# Altium schematic sheet ORD_BYPASS.SchDoc
size 420 x 297 mm; Address1: Address1; Address2: Address2; Address3: Address3; Address4: Address4; DocumentNumber: АБВГ.123456.001 Э3; SheetNumber: 1; Scale: 1:1; DocumentType: Схема электрическая принципиальная; FirstReferrence: АБВГ.123456.001
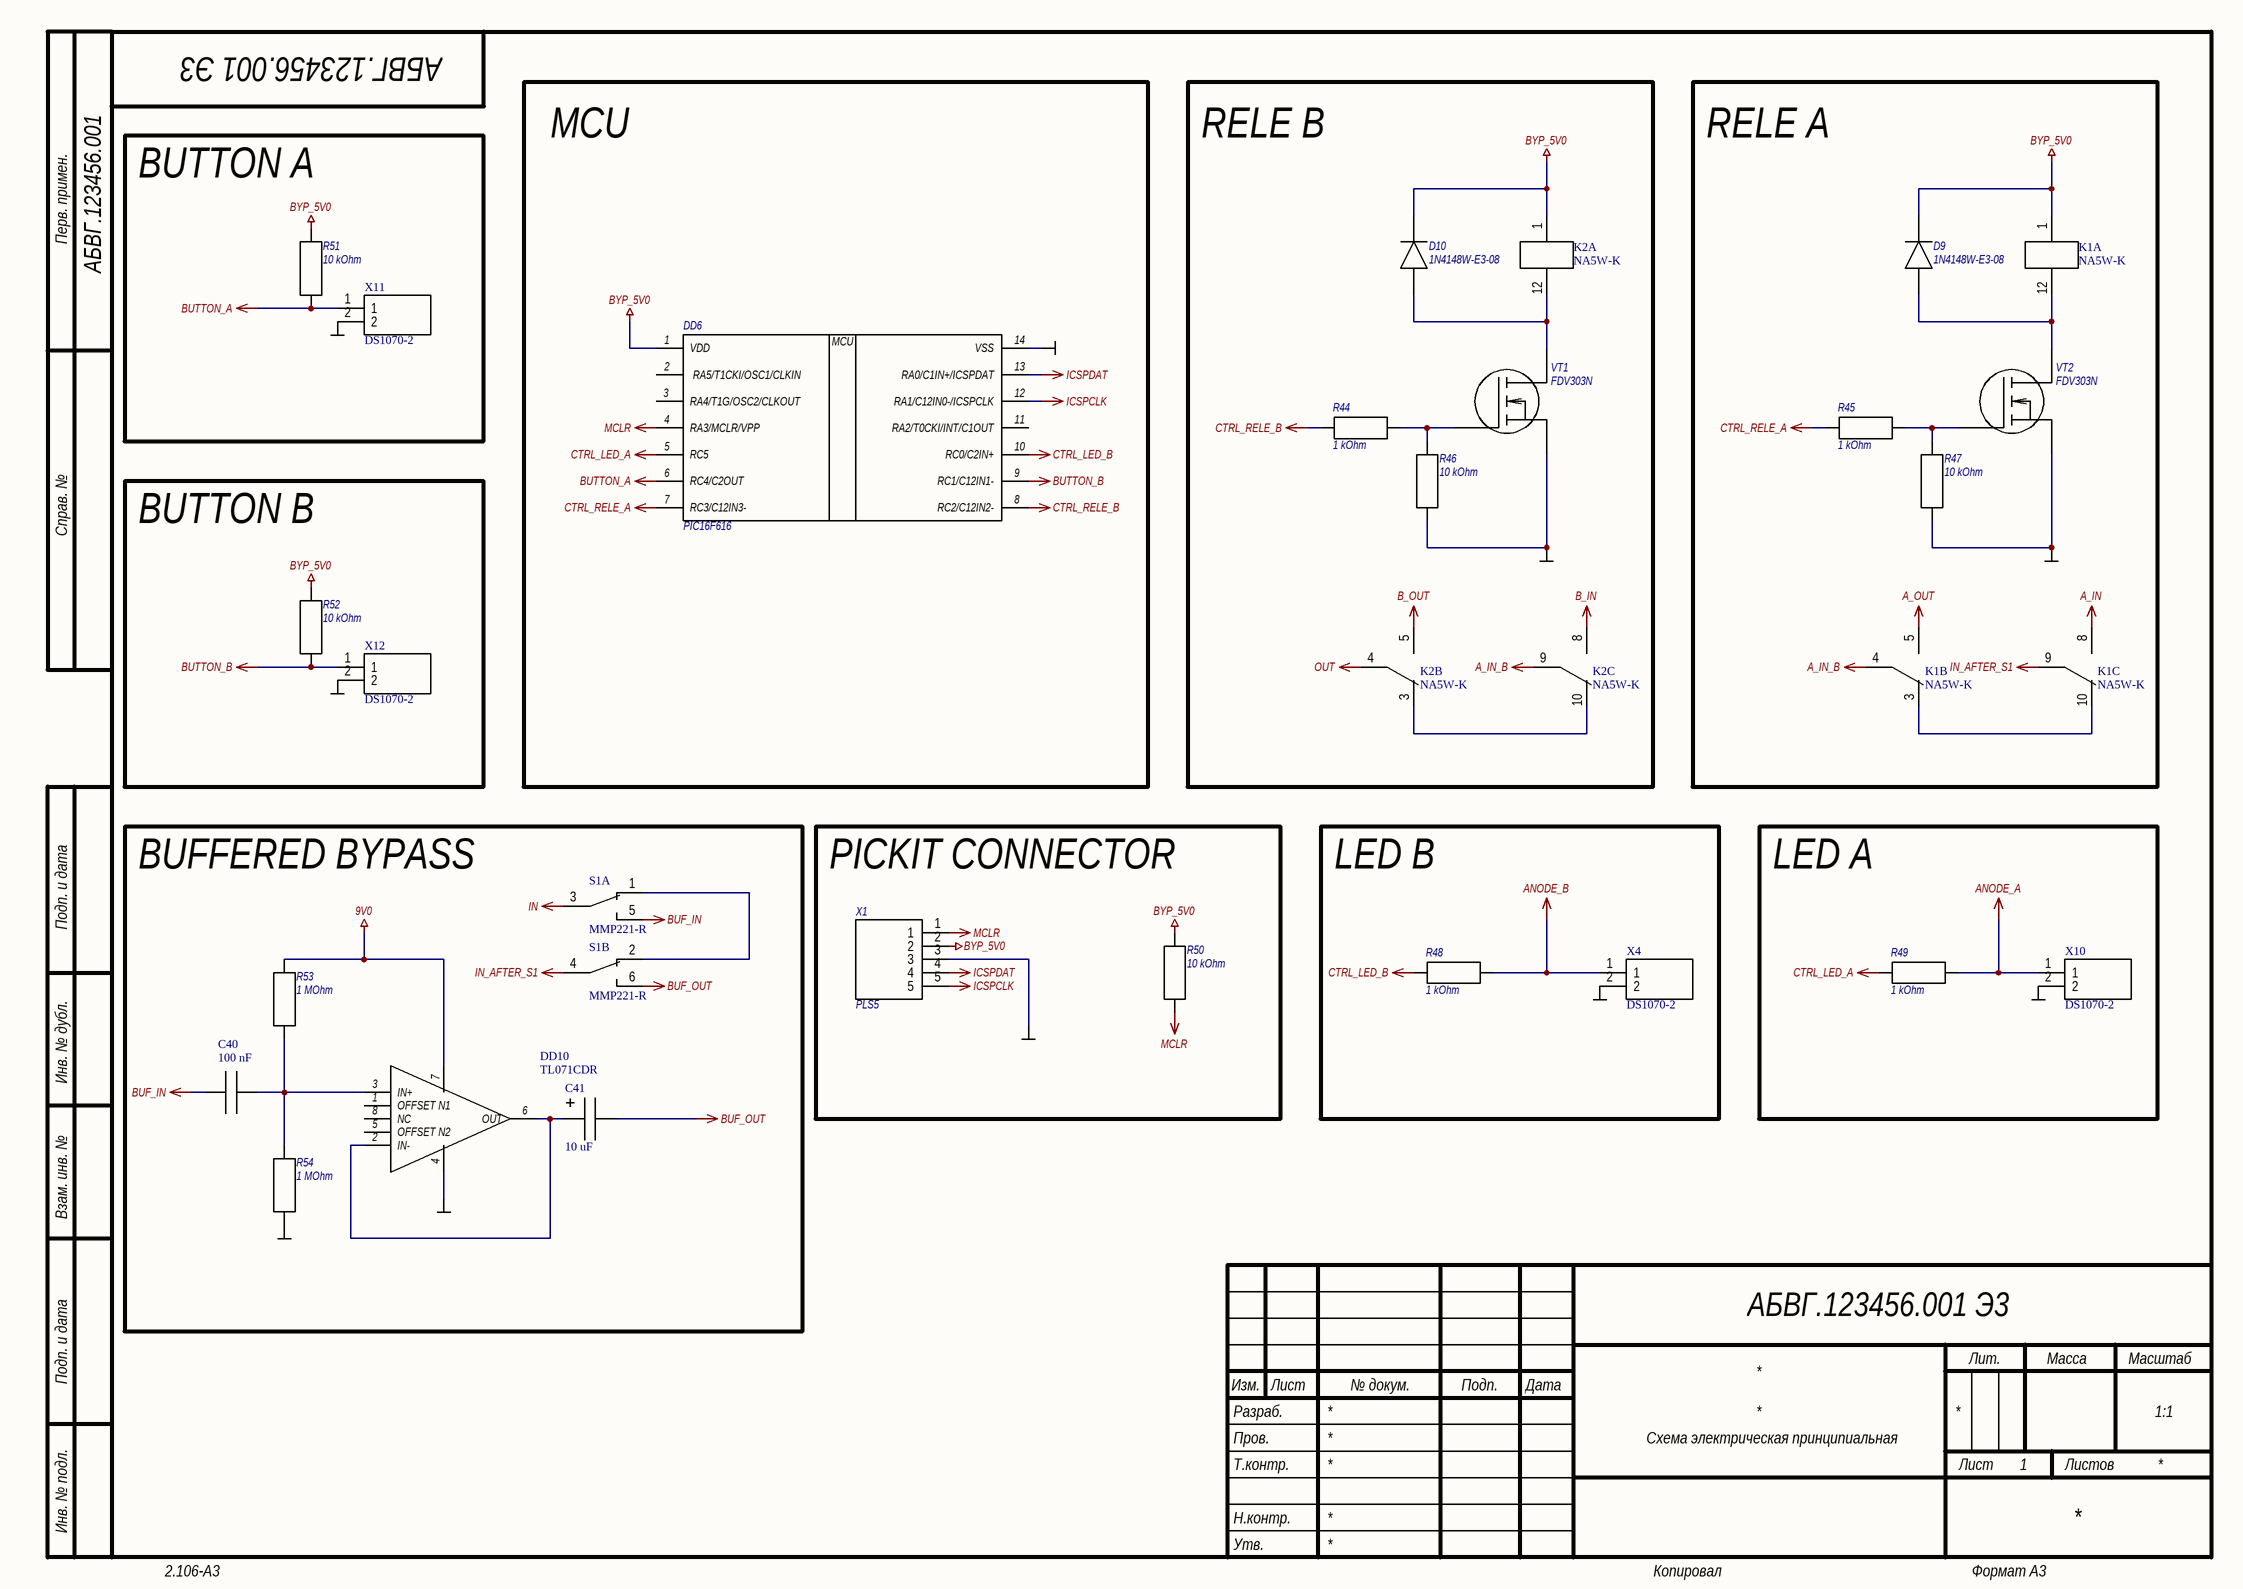
[diagram p0: ORD_BYPASS.SchDoc]

## Parts
C40  100 nF  [C0805[2012]]
C41  10 uF  [C3216_CASE-A]
D9  1N4148W-E3-08  [SOD123]
D10  1N4148W-E3-08  [SOD123]
DD6  PIC16F616  [SO14]
DD10  TL071CDR  [SO8]
K1  NA5W-K  [NA5W-K]  (parts A,B,C of 3)
K2  NA5W-K  [NA5W-K]  (parts A,B,C of 3)
R44  1 kOhm  [R0805[2012]]
R45  1 kOhm  [R0805[2012]]
R46  10 kOhm  [R0805[2012]]
R47  10 kOhm  [R0805[2012]]
R48  1 kOhm  [R0805[2012]]
R49  1 kOhm  [R0805[2012]]
R50  10 kOhm  [R0805[2012]]
R51  10 kOhm  [R0805[2012]]
R52  10 kOhm  [R0805[2012]]
R53  1 MOhm  [R0805[2012]]
R54  1 MOhm  [R0805[2012]]
S1  MMP221-R  [MMP221R]  (parts A,B of 2)
VT1  FDV303N  [SOT-23]
VT2  FDV303N  [SOT-23]
X1  PLS5  [PLS-5 (UP)]
X4  DS1070-2  [DS1070-2]
X10  DS1070-2  [DS1070-2]
X11  DS1070-2  [DS1070-2]
X12  DS1070-2  [DS1070-2]

## Blocks framed on the sheet
MCU: DD6
RELE B: D10 K2 R44 R46 VT1
RELE A: D9 K1 R45 R47 VT2
BUTTON A: R51 X11
BUTTON B: R52 X12
BUFFERED BYPASS: C40 C41 DD10 R53 R54 S1
PICKIT CONNECTOR: R50 X1
LED B: R48 X4
LED A: R49 X10

## Nets
9V0: DD10.7(VCC+) R53.2
A_IN: K1.8(NO_2)
A_IN_B: K1.4(COM_1) K2.9(COM_2)
A_OUT: K1.5(NO_1)
ANODE_A: R49.2 X10.1
ANODE_B: R48.2 X4.1
B_IN: K2.8(NO_2)
B_OUT: K2.5(NO_1)
BUF_IN: C40.1 S1.5(NO_1)
BUF_OUT: C41.2 S1.6(NO_2)
BUTTON_A: DD6.6(RC4/C2OUT) R51.1 X11.1
BUTTON_B: DD6.9(RC1/C12IN1-) R52.1 X12.1
BYP_5V0: D9.1(K) D10.1(K) DD6.1(VDD) K1.1(+(-)) K2.1(+(-)) R50.2 R51.2 R52.2 X1.2
CTRL_LED_A: DD6.5(RC5) R49.1
CTRL_LED_B: DD6.10(RC0/C2IN+) R48.1
CTRL_RELE_A: DD6.7(RC3/C12IN3-) R45.1
CTRL_RELE_B: DD6.8(RC2/C12IN2-) R44.1
GND: DD6.14(VSS) DD10.4(VCC-) R46.1 R47.1 R54.1 VT1.2(S) VT2.2(S) X1.3 X4.2 X10.2 X11.2 X12.2
ICSPCLK: DD6.12(RA1/C12IN0-/ICSPCLK) X1.5
ICSPDAT: DD6.13(RA0/C1IN+/ICSPDAT) X1.4
IN: S1.3(C_1)
IN_AFTER_S1: K1.9(COM_2) S1.4(C_2)
MCLR: DD6.4(RA3/MCLR/VPP) R50.1 X1.1
OUT: K2.4(COM_1)
NetC40_2: C40.2 DD10.3(IN+) R53.1 R54.2
NetC41_1: C41.1 DD10.2(IN-) DD10.6(OUT)
NetD9_2: D9.2(A) K1.12(-(+)) VT2.3(D)
NetD10_2: D10.2(A) K2.12(-(+)) VT1.3(D)
NetK1_3: K1.3(NC_1) K1.10(NC_2)
NetK2_3: K2.3(NC_1) K2.10(NC_2)
NetR44_2: R44.2 R46.2 VT1.1(G)
NetR45_2: R45.2 R47.2 VT2.1(G)
NetS1_1: S1.1(NC_1) S1.2(NC_2)

Not connected (* = marked no-connect by the designer): DD6 2(RA5/T1CKI/OSC1/CLKIN) 3(RA4/T1G/OSC2/CLKOUT) 11(RA2/T0CKI/INT/C1OUT); DD10 1(OFFSET_N1) 5(OFFSET_N2) 8(NC)

## Notes on the sheet
- Перв. примен.
- Справ. №
- Подп. и дата
- Инв. № дубл.
- Взам. инв. №
- Разраб.
- Изм.
- Лист
- № докум.
- Подп.
- Дата
- Лит.
- Масса
- Масштаб
- Пров.
- Т.контр.
- Листов
- Инв. № подл.
- Утв.
- Н.контр.
- 2.106-A3
- Копировал
- Формат А3
- (in symbol PIC16F616) MCU

## Library data of the parts
C40 = Capacitor: Manufacture: *; ManufacturerPartNumber: *; Power/Voltage: *; Quantity: *; Rem: *; TKE: *; Tolerance: *; Value: 100 nF; Корпус: *; Примечание: *
C41 = Capacitor_Pol: Manufacture: *; ManufacturerPartNumber: *; Power/Voltage: *; Quantity: *; Rem: *; TKE: *; Tolerance: *; Value: 10 uF; Корпус: *; Примечание: *
D9 D10 = 1N4148W-E3-08: Diode Switching 100V 0.15A SOD123 Vishay 1N4148W-E3-08 Switching Diode, 150mA 75V, 2-Pin SOD-123; Allied_Number: 70798350; Geometry.Height: 1.35mm; Manufacturer_Name: Vishay; Manufacturer_Part_Number: 1N4148W-E3-08; RS Part Number: 9189694; RS Price/Stock: http://uk.rs-online.com/web/p/products/9189694; Allied Price/Stock: http://www.alliedelec.com/vishay-small-signal-opto-products-ssp-1n4148w-e3-08/70798350/; Arrow Part Number: 1N4148W-E3-08; Arrow Price/Stock: https://www.arrow.com/en/products/1n4148w-e3-08/vishay; Datasheet Link: http://www.vishay.com/docs/85748/1n4148w.pdf
DD6 = PIC16F616: Flash-Based 8-Bit / CMOS Microcontroller; Manufacturer_Name: Texas Instruments; Manufacturer_Part_Number: LM386M-1/NOPB; Geometry.Height: 1.753mm; Mouser Part Number: 926-LM386M-1/NOPB; Mouser Price/Stock: https://www.mouser.com/Search/Refine.aspx?Keyword=926-LM386M-1%2FNOPB; RS Part Number: 5361366P; RS Price/Stock: http://uk.rs-online.com/web/p/products/5361366P; Datasheet Link: http://docs-emea.rs-online.com/webdocs/06e8/0900766b806e88be.pdf
DD10 = TL071CDR: TL071CDR, Operational Amplifier 4 MHz -18 to 18V, 8-Pin SO; Manufacturer_Name: STMicroelectronics; Manufacturer_Part_Number: LM358DT; Allied_Number: 70013708; Geometry.Height: 1.75mm; Mouser Part Number: 511-LM358DT; Mouser Price/Stock: https://www.mouser.com/Search/Refine.aspx?Keyword=511-LM358DT; RS Part Number: 7140827P; RS Price/Stock: http://uk.rs-online.com/web/p/products/7140827P; Allied Price/Stock: http://www.alliedelec.com/stmicroelectronics-lm358dt/70013708/; Datasheet Link: http://www.st.com/st-web-ui/static/active/en/resource/technical/document/datasheet/CD00000464.pdf
K1 K2 = NA5W-K: Low Signal Relays - PCB Mini Signal 5VDC; Manufacturer_Name: FUJITSU; Manufacturer_Part_Number: NA-5W-K; Geometry.Height: 10mm; Mouser Part Number: 817-NA-5W-K; Mouser Price/Stock: https://www.mouser.com/Search/Refine.aspx?Keyword=817-NA-5W-K; RS Part Number: 3716354; RS Price/Stock: https://uk.rs-online.com/web/p/products/3716354; Datasheet Link: http://www.mouser.com/datasheet/2/164/na-914632.pdf
R44-R54 = Resistor: Manufacture: *; ManufacturerPartNumber: *; Power/Voltage: *; Quantity: *; Rem: *; TKE: *; Tolerance: *; Корпус: *; Примечание: *
  R44 R45 R48 R49: Value: 1 kOhm
  R46 R47 R50-R52: Value: 10 kOhm
  R53 R54: Value: 1 MOhm
S1 = MMP221-R: PCB Slide Switch DPDT On-On 200 mA @ 12 V dc Slide; Manufacturer_Name: KNITTER-SWITCH; Geometry.Height: 3mm; Manufacturer_Part_Number: MMP221-R; Mouser Part Number: *; Mouser Price/Stock: *; RS Part Number: 7023564P; RS Price/Stock: http://uk.rs-online.com/web/p/products/7023564P; Datasheet Link: http://www.knitter-switch.com/var/pms/model-603/MMP%20221-R.pdf
VT1 VT2 = FDV303N: N - channel power mosfet
X1 = PLS5: 2.54 mm; System: Connector
X4 X10-X12 = DS1070-2: 2.54 mm, male; System: Connector